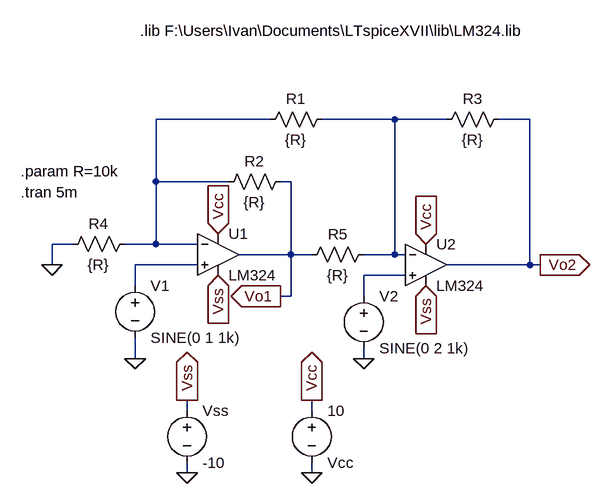
[diagram p0: schematic TP1_MORALES_SUAREZ_TORRES_C1.asc]
TP1_MORALES_SUAREZ_TORRES_C1.asc, the LTspice schematic file:
Version 4
SHEET 1 880 680
WIRE 80 48 -96 48
WIRE 272 48 160 48
WIRE 352 48 272 48
WIRE 480 48 432 48
WIRE -96 144 -96 48
WIRE 16 144 -96 144
WIRE 112 144 96 144
WIRE -224 240 -256 240
WIRE -96 240 -96 144
WIRE -96 240 -144 240
WIRE -32 240 -96 240
WIRE 112 256 112 144
WIRE 112 256 32 256
WIRE 144 256 112 256
WIRE 272 256 272 48
WIRE 272 256 224 256
WIRE 288 256 272 256
WIRE -256 272 -256 240
WIRE -32 272 -128 272
WIRE 480 272 480 48
WIRE 480 272 352 272
WIRE 496 272 480 272
WIRE 288 288 224 288
WIRE -128 304 -128 272
WIRE 112 320 112 256
WIRE 112 320 96 320
WIRE 224 320 224 288
WIRE -128 416 -128 384
WIRE 224 416 224 400
WIRE -48 496 -48 480
WIRE 144 496 144 480
WIRE -48 592 -48 576
WIRE 144 592 144 576
FLAG 144 592 0
FLAG -48 592 0
FLAG -256 272 0
FLAG -128 416 0
FLAG 224 416 0
FLAG 496 272 Vo2
IOPIN 496 272 Out
FLAG 96 320 Vo1
IOPIN 96 320 Out
FLAG 144 480 Vcc
IOPIN 144 480 Out
FLAG 0 224 Vcc
IOPIN 0 224 In
FLAG 320 240 Vcc
IOPIN 320 240 In
FLAG -48 480 Vss
IOPIN -48 480 Out
FLAG 0 288 Vss
IOPIN 0 288 In
FLAG 320 304 Vss
IOPIN 320 304 In
SYMBOL OpAmps\\LM324 0 256 R0
SYMATTR InstName U1
SYMBOL OpAmps\\LM324 320 272 R0
SYMATTR InstName U2
SYMBOL res 176 32 R90
WINDOW 0 0 56 VBottom 2
WINDOW 3 32 56 VTop 2
SYMATTR InstName R1
SYMATTR Value {R}
SYMBOL res 112 128 R90
WINDOW 0 0 56 VBottom 2
WINDOW 3 32 56 VTop 2
SYMATTR InstName R2
SYMATTR Value {R}
SYMBOL res 448 32 R90
WINDOW 0 0 56 VBottom 2
WINDOW 3 32 56 VTop 2
SYMATTR InstName R3
SYMATTR Value {R}
SYMBOL res -128 224 R90
WINDOW 0 0 56 VBottom 2
WINDOW 3 32 56 VTop 2
SYMATTR InstName R4
SYMATTR Value {R}
SYMBOL voltage 144 480 R0
WINDOW 0 24 96 Left 2
WINDOW 3 24 16 Left 2
WINDOW 123 0 0 Left 0
WINDOW 39 0 0 Left 0
SYMATTR InstName Vcc
SYMATTR Value 10
SYMBOL voltage -48 480 R0
WINDOW 123 0 0 Left 0
WINDOW 39 0 0 Left 0
SYMATTR InstName Vss
SYMATTR Value -10
SYMBOL res 240 240 R90
WINDOW 0 0 56 VBottom 2
WINDOW 3 32 56 VTop 2
SYMATTR InstName R5
SYMATTR Value {R}
SYMBOL voltage -128 288 R0
WINDOW 123 0 0 Left 0
WINDOW 39 0 0 Left 0
SYMATTR InstName V1
SYMATTR Value SINE(0 1 1k)
SYMBOL voltage 224 304 R0
WINDOW 123 0 0 Left 0
WINDOW 39 0 0 Left 0
SYMATTR InstName V2
SYMATTR Value SINE(0 2 1k)
TEXT -120 -88 Left 2 !.lib F:\\Users\\Ivan\\Documents\\LTspiceXVII\\lib\\LM324.lib
TEXT -304 128 Left 2 !.param R=10k
TEXT -304 160 Left 2 !.tran 5m

The netlist it stands for:
* TP1_MORALES_SUAREZ_TORRES_C1.asc
* U1: LM324 (symbol OpAmps\LM324 not available, pins judged from their places): In+=N003 In-=N001 V+=Vcc V-=Vss OUT=Vo1
* U2: LM324 (symbol OpAmps\LM324 not available, pins judged from their places): In+=N004 In-=N002 V+=Vcc V-=Vss OUT=Vo2
R1 N002 N001 {R}
R2 Vo1 N001 {R}
R3 Vo2 N002 {R}
R4 N001 0 {R}
Vcc Vcc 0 10
Vss Vss 0 -10
R5 N002 Vo1 {R}
V1 N003 0 SINE(0 1 1k)
V2 N004 0 SINE(0 2 1k)
.lib F:\Users\Ivan\Documents\LTspiceXVII\lib\LM324.lib
.param R=10k
.tran 5m
.backanno
.end